# EAGLE design watchdog (EAGLE 4.16)
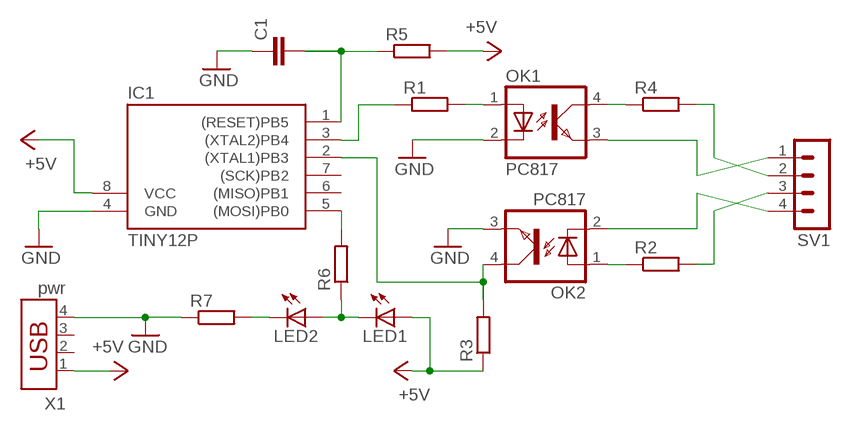
[diagram p0: schematic, sheet 1]

## Parts
C1  C-EUC1206  [C1206]
IC1  TINY12P  [DIL08]
LED1  LEDCHIPLED_1206  [CHIPLED_1206]
LED2  LEDCHIPLED_1206  [CHIPLED_1206]
OK1  PC817  [DIL04]
OK2  PC817  [DIL04]
R1  R-EU_M1206  [M1206]
R2  R-EU_M1206  [M1206]
R3  R-EU_M1206  [M1206]
R4  R-EU_M1206  [M1206]
R5  R-EU_M1206  [M1206]
R6  R-EU_M1206  [M1206]
R7  R-EU_M1206  [M1206]
SV1  MA04-1  [MA04-1]
X1  pwr  USB-787616  [USB]

## Nets
+5V: IC1.8(VCC) LED1.A R3.1 R5.2 X1.1
GND: C1.1 IC1.4(GND) OK1.2(C) OK2.3(EMIT) R7.1 X1.4
N$1: OK2.1(A) R2.1
N$2: R4.2 SV1.2
N$3: OK1.3(EMIT) SV1.1
N$4: OK2.2(C) SV1.4
N$5: R2.2 SV1.3
N$6: OK1.1(A) R1.2
N$7: IC1.3((XTAL2)PB4) R1.1
N$8: IC1.5((MOSI)PB0) R6.2
N$9: OK1.4(COL) R4.1
N$10: C1.2 IC1.1((RESET)PB5) R5.1
N$11: IC1.2((XTAL1)PB3) OK2.4(COL) R3.2
N$12: LED1.C LED2.A R6.1
N$14: LED2.C R7.2
Unconnected: IC1.6((MISO)PB1) IC1.7((SCK)PB2) X1.2 X1.3

## Library data of the parts
C1 = rcl:C-EU: CAPACITOR, European symbol
IC1 = atmel:TINY12*: MICROCONTROLLER 1 Kbytes FLASH 64 bytes EEPROM
LED1 LED2 = led:LED: LED OSRAM: - CHIPLED LG R971, LG N971, LY N971, LG Q971, LY Q971, LO R971, LY R971 LH N974, LH R974 LS Q976, LO Q976, LY Q976 LO Q996 - Hyper CHIPLED LW Q18S LB Q993, LB Q99A, LB R99A - SideLED LS A670, LO A670, LY A670, LG A670, LP A670 LB A673, LV A673, LT A673, LW A673 LH A674 LY A675 LS A676, LA A676, LO A676, LY A676, LW A676 LS A679, LY A679, LG A679 - Hyper Micro SIDELED® LS Y876, LA Y876, LO Y876, LY Y876 LT Y87S - SmartLED LW L88C, LW L88S LB L89C, LB L89S, LG L890 LS L89K, LO L89K, LY L89K LS L896, LA L896, LO L896, LY L896 - TOPLED LS T670, LO T670, LY T670, LG T670, LP T670 LSG T670, LSP T670, LSY T670, LOP T670, LYG T670 LG T671, LOG T671, LSG T671 LB T673, LV T673, LT T673, LW T673 LH T674 LS T676, LA T676, LO T676, LY T676, LB T676, LH T676, LSB T676, LW T676 LB T67C, LV T67C, LT T67C, LS T67K, LO T67K, LY T67K, LW E67C LS E67B, LA E67B, LO E67B, LY E67B, LB E67C, LV E67C, LT E67C LW T67C LS T679, LY T679, LG T679 LS T770, LO T770, LY T770, LG T770, LP T770 LB T773, LV T773, LT T773, LW T773 LH T774 LS E675, LA E675, LY E675, LS T675 LS T776, LA T776, LO T776, LY T776, LB T776 LHGB T686 LT T68C, LB T68C - Hyper Mini TOPLED® LB M676 - Mini TOPLED Santana® LG M470 LS M47K, LO M47K, LY M47K Source: http://www.osram.convergy.de - LUMILED® LXK2-PW12-R00, LXK2-PW12-S00, LXK2-PW14-U00, LXK2-PW14-V00 LXK2-PM12-R00, LXK2-PM12-S00, LXK2-PM14-U00 LXK2-PE12-Q00, LXK2-PE12-R00, LXK2-PE12-S00, LXK2-PE14-T00, LXK2-PE14-U00 LXK2-PB12-K00, LXK2-PB12-L00, LXK2-PB12-M00, LXK2-PB14-N00, LXK2-PB14-P00, LXK2-PB14-Q00 LXK2-PR12-L00, LXK2-PR12-M00, LXK2-PR14-Q00, LXK2-PR14-R00 LXK2-PD12-Q00, LXK2-PD12-R00, LXK2-PD12-S00 LXK2-PH12-R00, LXK2-PH12-S00 LXK2-PL12-P00, LXK2-PL12-Q00, LXK2-PL12-R00 Source: www.luxeon.com
OK1 OK2 = optocoupler:PC817: SHARP OPTO COUPLER
R1-R7 = rcl:R-EU_: RESISTOR, European symbol
SV1 = con-lstb:MA04-1: PIN HEADER
X1 = con-amp:USB-787616: AMP connector

## Board
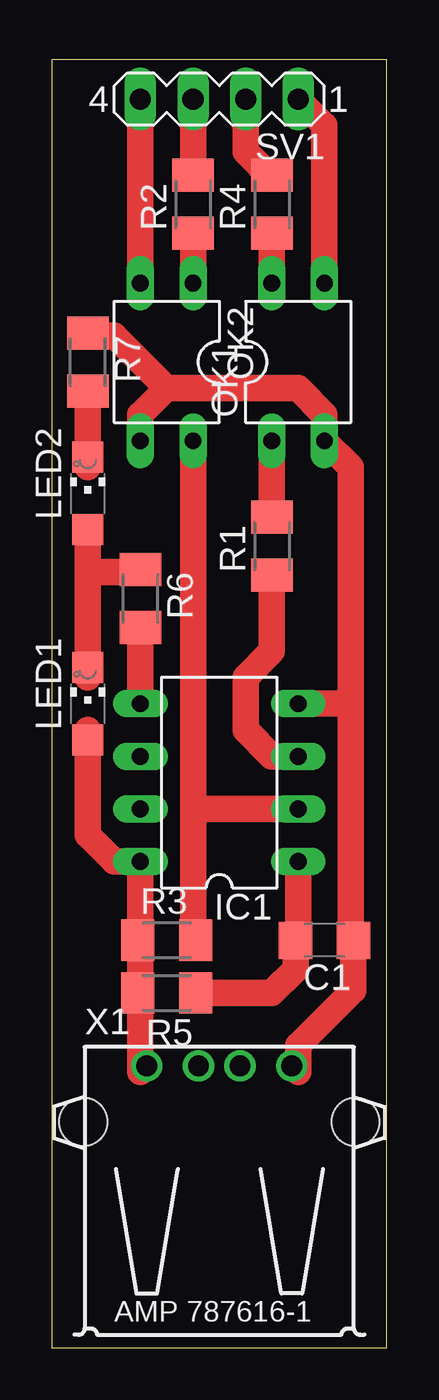
[diagram p1: board, top side]

Size 16.18 x 62.22 mm. Coordinates in mm from the lower left corner, seen from the top.
Outline: 0,0 16.18,0 16.18,62.22 0,62.22 0,0
Copper layers (1*16): Top 0.035mm / dielectric 1.5mm / Bottom 0.035mm
Design rules "default": minimum track width 10mil, minimum drill 24mil, track to track 8mil, track to pad 8mil, pad to pad 8mil, via to via 8mil, smd to smd 8mil, copper to edge 40mil, drill to drill 8mil, minimum pad ring 10mil, minimum via ring 8mil, stop-mask expansion 4mil, vias tented up to drill 0mil, thermal gap 10mil

### Footprints (pad centres in the part's own frame; a part is rotated, then mirrored left to right if it is on the bottom)
C1206 = smd 1.6 x 1.8: 1 -1.4,0; 2 1.4,0
DIL08 = drill 0.813 long: 1 -3.81,-3.81; 2 -1.27,-3.81; 3 1.27,-3.81; 4 3.81,-3.81; 5 3.81,3.81; 6 1.27,3.81; 7 -1.27,3.81; 8 -3.81,3.81
CHIPLED_1206 = smd 1.5 x 1.5: A 0,-1.75; C 0,1.75
DIL04 = drill 0.813 long: 1 -1.27,-3.81; 2 1.27,-3.81; 3 1.27,3.81; 4 -1.27,3.81
M1206 = smd 1.6 x 2: 1 -1.4,0; 2 1.4,0
MA04-1 = drill 1.016 long: 1 -3.81,0; 2 -1.27,0; 3 1.27,0; 4 3.81,0
USB = drill 1 round: 1 -3.5,12.99; 2 -1,12.99; 3 1,12.99; 4 3.5,12.99 | hole 2.3: -6.57,10.28; 6.57,10.28

### Placement (x,y rotation side)
C1  13.17,19.68 180 top
IC1  8.09,27.3 90 top
LED1  1.74,31.11 0 top
LED2  1.74,41.27 0 top
OK1  11.9,47.62 0 top
OK2  5.55,47.62 180 top
R1  10.63,38.73 90 top
R2  6.82,55.24 90 top
R3  5.55,19.68 0 top
R4  10.63,55.24 90 top
R5  5.55,17.14 180 top
R6  4.28,36.19 270 top
R7  1.74,47.62 270 top
SV1  8.09,60.32 180 top
X1  8.09,0.63 0 top

### Tracks (layer width: path | path; a pad name or v marks a point on that pad's centre or on a via)
+5V
  Top 0.406: R5.2 4.28,17.14 | 4.28,19.68 R3.1
  Top 1.27: X1.1 4.57,13.62 4.28,13.33 4.28,17.14 4.28,19.68 IC1.8 3.01,23.49 1.74,24.76 LED1.A 1.74,29.84
GND
  Top 0.406: C1.1 14.44,19.68
  Top 1.27: OK2.3 4.28,45.08 5.55,46.35 | 5.55,46.35 11.9,46.35 13.17,45.08 OK1.2 14.44,42.54 14.44,31.11 | C1.1 14.57,17.27 11.9,14.6 11.9,13.33 11.61,13.62 X1.4 | 14.44,19.68 14.44,31.11 | 14.44,31.11 IC1.4 | 5.55,46.35 3.01,48.89 1.74,48.89 R7.1
N$1
  Top 0.406: R2.1 6.82,53.97
  Top 1.27: R2.1 OK2.1
N$2
  Top 0.406: R4.2 10.63,56.51
  Top 1.27: SV1.2 9.36,57.78 10.63,56.51
N$3
  Top 1.27: OK1.3 13.17,59.05 SV1.1
N$4
  Top 1.27: OK2.2 SV1.4
N$5
  Top 1.27: R2.2 SV1.3
N$6
  Top 1.27: 10.63,40 R1.2 OK1.1
N$7
  Top 1.27: IC1.3 10.63,28.57 9.36,29.84 9.36,32.38 10.63,33.65 R1.1
N$8
  Top 1.27: R6.2 IC1.5
N$9
  Top 1.27: OK1.4 R4.1
N$10
  Top 0.406: C1.2 11.9,19.68 | R5.1 6.82,17.14
  Top 1.27: 11.9,19.68 IC1.1 | C1.2 11.77,18.28 10.63,17.14 R5.1
N$11
  Top 0.406: R3.2 6.82,19.68
  Top 1.27: 6.82,19.68 6.82,26.03 | 6.82,26.03 IC1.2 | 6.82,26.03 OK2.4
N$12
  Top 1.27: 1.74,32.38 LED1.C 1.74,37.46 | 1.74,37.46 LED2.A | R6.1 4.28,37.46 1.74,37.46
N$14
  Top 1.27: 1.74,42.54 LED2.C R7.2